# Altium schematic sheet optopara_rroE3.SchDoc
size 420 x 297 mm; SheetNumber: 1; SheetTotal: 1
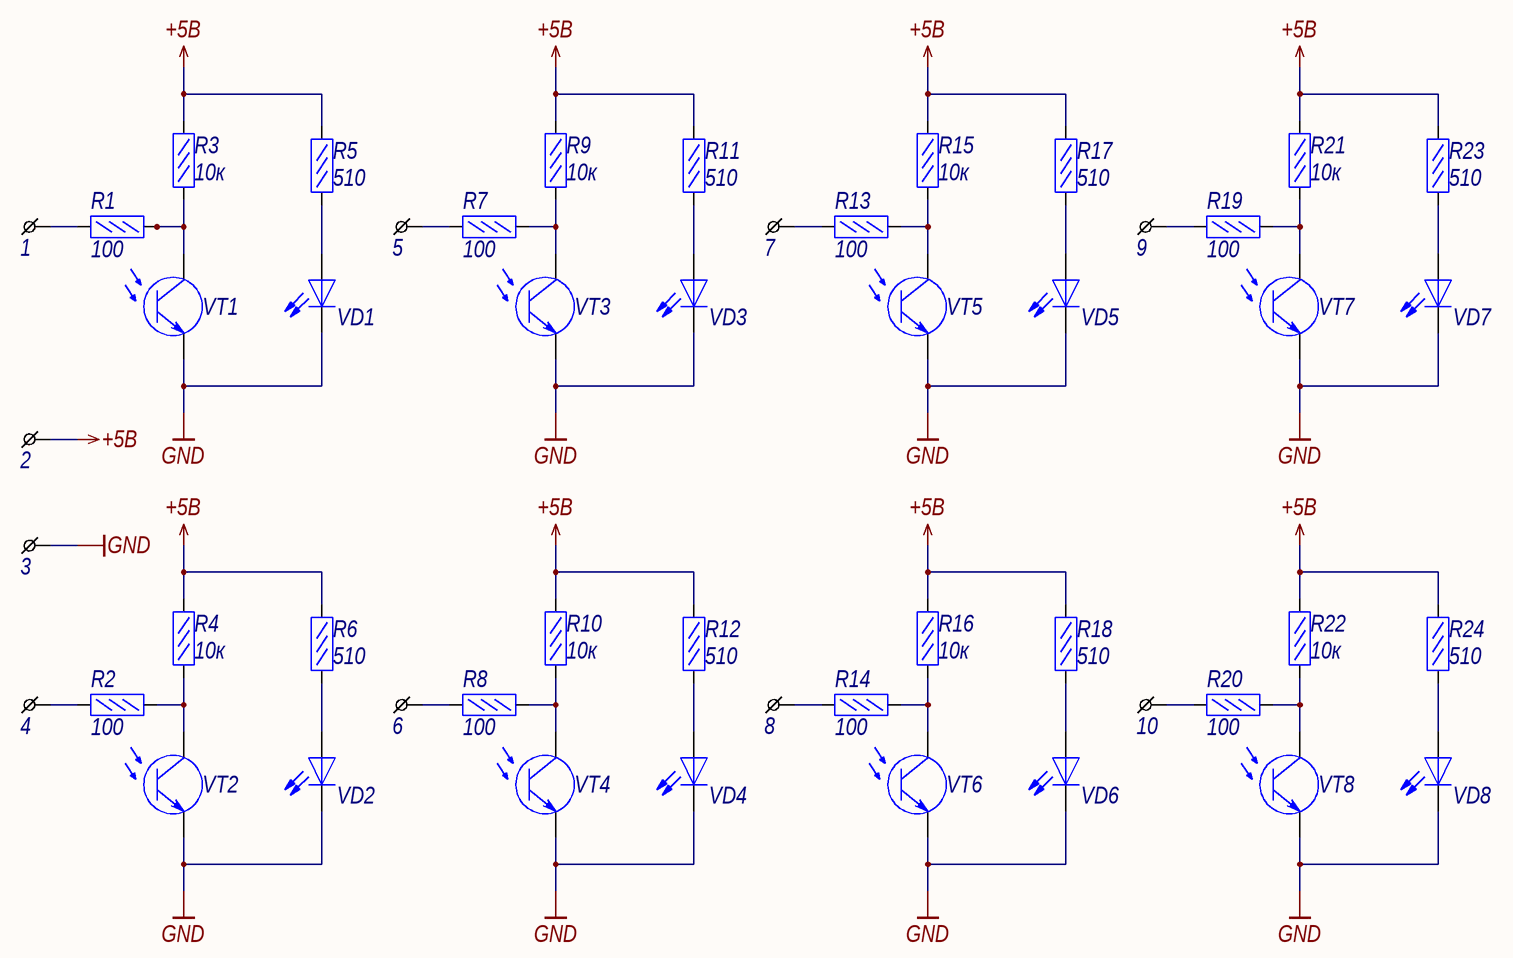
[diagram p0: optopara_rroE3.SchDoc]

## Parts
1  MNT_HOLE  [TP_1X1]  (value not drawn)  (no BOM)
2  MNT_HOLE  [TP_1X1]  (value not drawn)  (no BOM)
3  MNT_HOLE  [TP_1X1]  (value not drawn)  (no BOM)
4  MNT_HOLE  [TP_1X1]  (value not drawn)  (no BOM)
5  MNT_HOLE  [TP_1X1]  (value not drawn)  (no BOM)
6  MNT_HOLE  [TP_1X1]  (value not drawn)  (no BOM)
7  MNT_HOLE  [TP_1X1]  (value not drawn)  (no BOM)
8  MNT_HOLE  [TP_1X1]  (value not drawn)  (no BOM)
9  MNT_HOLE  [TP_1X1]  (value not drawn)  (no BOM)
10  MNT_HOLE  [TP_1X1]  (value not drawn)  (no BOM)
R1  100  [R0603]
R2  100  [R0603]
R3  10к  [R0603]
R4  10к  [R0603]
R5  510  [R0603]
R6  510  [R0603]
R7  100  [R0603]
R8  100  [R0603]
R9  10к  [R0603]
R10  10к  [R0603]
R11  510  [R0603]
R12  510  [R0603]
R13  100  [R0603]
R14  100  [R0603]
R15  10к  [R0603]
R16  10к  [R0603]
R17  510  [R0603]
R18  510  [R0603]
R19  100  [R0603]
R20  100  [R0603]
R21  10к  [R0603]
R22  10к  [R0603]
R23  510  [R0603]
R24  510  [R0603]
VD1  (no value)  [LED_5mm]
VD2  (no value)  [LED_5mm]
VD3  (no value)  [LED_5mm]
VD4  (no value)  [LED_5mm]
VD5  (no value)  [LED_5mm]
VD6  (no value)  [LED_5mm]
VD7  (no value)  [LED_5mm]
VD8  (no value)  [LED_5mm]
VT1  -  [LED_5mm]  (value not drawn)
VT2  -  [LED_5mm]  (value not drawn)
VT3  -  [LED_5mm]  (value not drawn)
VT4  -  [LED_5mm]  (value not drawn)
VT5  -  [LED_5mm]  (value not drawn)
VT6  -  [LED_5mm]  (value not drawn)
VT7  -  [LED_5mm]  (value not drawn)
VT8  -  [LED_5mm]  (value not drawn)

## Nets
+5В: 2.1 R3.2 R4.2 R5.2 R6.2 R9.2 R10.2 R11.2 R12.2 R15.2 R16.2 R17.2 R18.2 R21.2 R22.2 R23.2 R24.2
GND: 3.1 VD1.2(K) VD2.2(K) VD3.2(K) VD4.2(K) VD5.2(K) VD6.2(K) VD7.2(K) VD8.2(K) VT1.2 VT2.2 VT3.2 VT4.2 VT5.2 VT6.2 VT7.2 VT8.2
Net1_1: 1.1 R1.1
Net4_1: 4.1 R2.1
Net5_1: 5.1 R7.1
Net6_1: 6.1 R8.1
Net7_1: 7.1 R13.1
Net8_1: 8.1 R14.1
Net9_1: 9.1 R19.1
Net10_1: 10.1 R20.1
NetR1_2: R1.2 R3.1 VT1.1
NetR2_2: R2.2 R4.1 VT2.1
NetR5_1: R5.1 VD1.1(A)
NetR6_1: R6.1 VD2.1(A)
NetR7_2: R7.2 R9.1 VT3.1
NetR8_2: R8.2 R10.1 VT4.1
NetR11_1: R11.1 VD3.1(A)
NetR12_1: R12.1 VD4.1(A)
NetR13_2: R13.2 R15.1 VT5.1
NetR14_2: R14.2 R16.1 VT6.1
NetR17_1: R17.1 VD5.1(A)
NetR18_1: R18.1 VD6.1(A)
NetR19_2: R19.2 R21.1 VT7.1
NetR20_2: R20.2 R22.1 VT8.1
NetR23_1: R23.1 VD7.1(A)
NetR24_1: R24.1 VD8.1(A)

## Notes on the sheet
- Перв. примен.
- Справ. №
- Подп. и дата
- Инв. № дубл.
- Взам. инв. №
- Изм.
- Лист
- № докум.
- Подп.
- Дата
- Лит.
- Масса
- Масштаб
- Т.контр.
- Пров.
- Разраб.
- Листов
- Инв. № подл.
- Н.контр.
- Файл:
- Утв.
- Копировал
- Формат

## Library data of the parts
R1 R2 R7 R8 R13 R14 R19 R20 = RC0603FR-07100RL: Резистор 100 Ом 0,1Вт 1%; Manufacturer: YAGEO; Name: RC0603FR-07100RL; Tolerance: 1%; Value: 100
R3 R4 R9 R10 R15 R16 R21 R22 = RC0603FR-0710KL: Резистор 10кОм 0,063Вт 1%; Manufacturer: YAGEO; Name: RC0603FR-0710KL; Tolerance: 1%; Value: 10к
R5 R6 R11 R12 R17 R18 R23 R24 = RC0603FR-07510RL: Резистор 510 Ом 0,1Вт 1%; Manufacturer: YAGEO; Name: RC0603FR-07510RL; Tolerance: 1%; Value: 510
VD1-VD8 = IR_LED: ИК светодиод
VT1-VT8 = BJTfoto: Биполярный NPN транзистор; TU: -; Manufacturer: -; Name: -